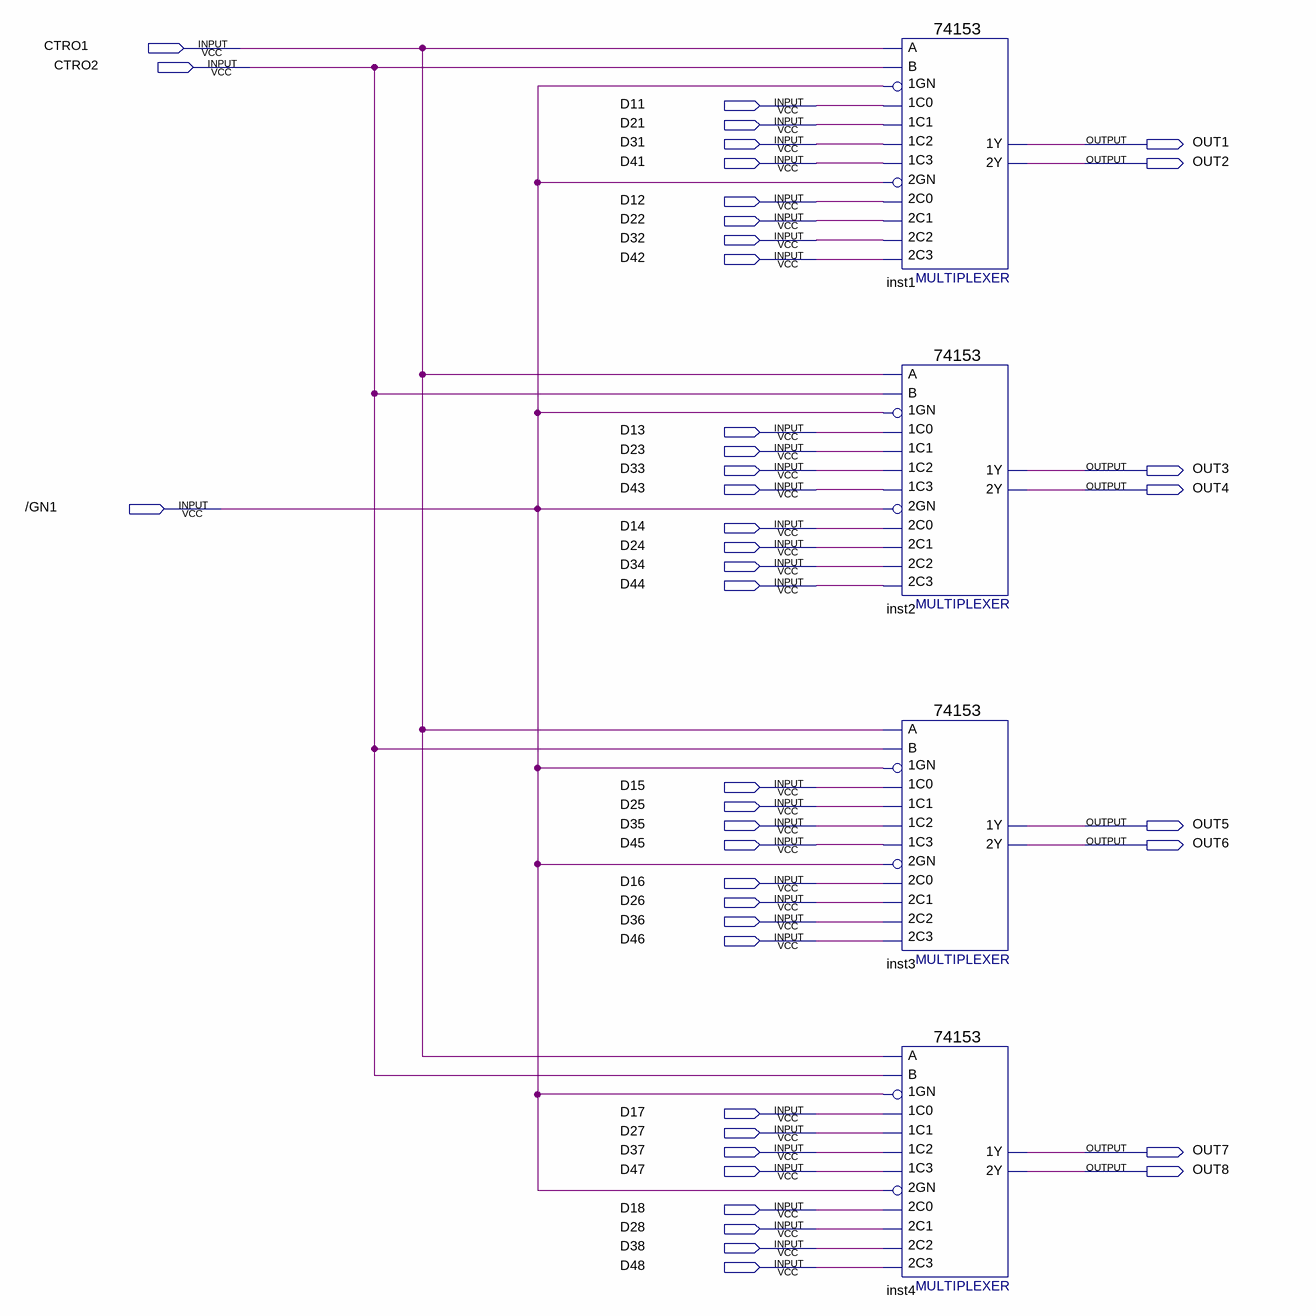
[diagram p0: schematic sheet]
// Quartus schematic SELECT-FOUR.bdf as structural Verilog: 4 symbols, 43 pins
module \SELECT-FOUR  (
  input  CTRO1,
  input  CTRO2,
  input  D11,
  input  D21,
  input  D31,
  input  D41,
  input  D12,
  input  D22,
  input  D32,
  input  D42,
  input  D13,
  input  D23,
  input  D33,
  input  D43,
  input  \/GN1 ,
  input  D14,
  input  D24,
  input  D34,
  input  D44,
  input  D15,
  input  D25,
  input  D35,
  input  D45,
  input  D16,
  input  D26,
  input  D36,
  input  D46,
  input  D17,
  input  D27,
  input  D37,
  input  D47,
  input  D18,
  input  D28,
  input  D38,
  input  D48,
  output OUT1,
  output OUT2,
  output OUT3,
  output OUT4,
  output OUT5,
  output OUT6,
  output OUT7,
  output OUT8
);

  \74153  inst1 (
    .\1C1 (D21), .\1GN (\/GN1 ), .\1C0 (D11), .\2C0 (D12), .\2GN (\/GN1 ), .\2C2 (D32), .\1C2 (D31),
    .\1C3 (D41), .B(CTRO2), .A(CTRO1), .\2C1 (D22), .\2C3 (D42), .\1Y (OUT1), .\2Y (OUT2));
  \74153  inst2 (
    .\1C1 (D23), .\1GN (\/GN1 ), .\1C0 (D13), .\2C0 (D14), .\2GN (\/GN1 ), .\2C2 (D34), .\1C2 (D33),
    .\1C3 (D43), .B(CTRO2), .A(CTRO1), .\2C1 (D24), .\2C3 (D44), .\1Y (OUT3), .\2Y (OUT4));
  \74153  inst3 (
    .\1C1 (D25), .\1GN (\/GN1 ), .\1C0 (D15), .\2C0 (D16), .\2GN (\/GN1 ), .\2C2 (D36), .\1C2 (D35),
    .\1C3 (D45), .B(CTRO2), .A(CTRO1), .\2C1 (D26), .\2C3 (D46), .\1Y (OUT5), .\2Y (OUT6));
  \74153  inst4 (
    .\1C1 (D27), .\1GN (\/GN1 ), .\1C0 (D17), .\2C0 (D18), .\2GN (\/GN1 ), .\2C2 (D38), .\1C2 (D37),
    .\1C3 (D47), .B(CTRO2), .A(CTRO1), .\2C1 (D28), .\2C3 (D48), .\1Y (OUT7), .\2Y (OUT8));
endmodule
